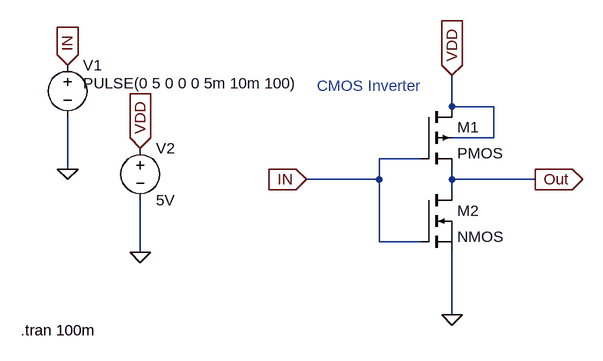
[diagram p0: schematic CMOS Inverter.asc]
CMOS Inverter.asc, the LTspice schematic file:
Version 4
SHEET 1 880 680
WIRE 240 96 240 48
WIRE 304 96 240 96
WIRE 304 144 304 96
WIRE 304 144 240 144
WIRE 192 176 128 176
WIRE -352 192 -352 112
WIRE 128 208 128 176
WIRE 128 208 16 208
WIRE 240 208 240 192
WIRE 368 208 240 208
WIRE 240 224 240 208
WIRE 128 304 128 208
WIRE 192 304 128 304
WIRE -240 320 -240 240
WIRE 240 416 240 320
FLAG 240 416 0
FLAG 16 208 IN
IOPIN 16 208 In
FLAG 368 208 Out
IOPIN 368 208 Out
FLAG 240 48 VDD
IOPIN 240 48 In
FLAG -240 160 VDD
IOPIN -240 160 In
FLAG -352 32 IN
IOPIN -352 32 In
FLAG -352 192 0
FLAG -240 320 0
SYMBOL nmos 192 224 R0
SYMATTR InstName M2
SYMBOL voltage -352 16 R0
WINDOW 3 24 44 Left 2
WINDOW 123 0 0 Left 0
WINDOW 39 0 0 Left 0
SYMATTR Value PULSE(0 5 0 0 0 5m 10m 100)
SYMATTR InstName V1
SYMBOL voltage -240 144 R0
WINDOW 123 0 0 Left 0
WINDOW 39 0 0 Left 0
SYMATTR InstName V2
SYMATTR Value 5V
SYMBOL pmos4 192 96 R0
SYMATTR InstName M1
TEXT 32 64 Left 2 ;CMOS Inverter
TEXT -424 440 Left 2 !.tran 100m

The netlist it stands for:
* CMOS Inverter.asc
M2 Out IN 0 0 NMOS
V1 IN 0 PULSE(0 5 0 0 0 5m 10m 100)
V2 VDD 0 5V
M1 VDD IN Out VDD PMOS
.model NMOS NMOS
.model PMOS PMOS
.lib standard.mos
* CMOS Inverter
.tran 100m
.backanno
.end

* Results of the author's LTspice run, read from the files saved beside the schematic
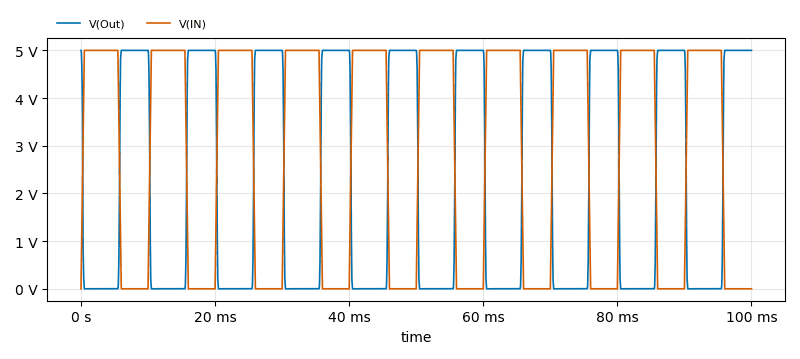
[diagram p1: Transient Analysis of CMOS Inverter.asc, plotted from the saved traces]
* Transient Analysis, 1 run:
*   V(Out): min 0 V, max 5 V, average 2.25 V, rms 3.319 V, last 5 V
*   V(IN): min 0 V, max 5 V, average 2.75 V, rms 3.653 V, last 0 V